# EAGLE design highpower-new5pad (EAGLE 9.2.2)
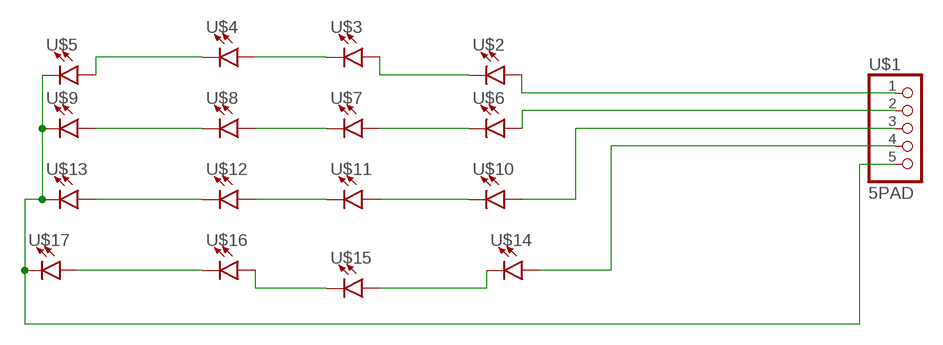
[diagram p0: schematic, sheet 1]

## Parts
U$1  5PAD  [1X05SMD/90]
U$2  LEDHIGHPOWER  [HIGHPOWERLED]
U$3  LEDHIGHPOWER  [HIGHPOWERLED]
U$4  LEDHIGHPOWER  [HIGHPOWERLED]
U$5  LEDHIGHPOWER  [HIGHPOWERLED]
U$6  LEDHIGHPOWER  [HIGHPOWERLED]
U$7  LEDHIGHPOWER  [HIGHPOWERLED]
U$8  LEDHIGHPOWER  [HIGHPOWERLED]
U$9  LEDHIGHPOWER  [HIGHPOWERLED]
U$10  LEDHIGHPOWER  [HIGHPOWERLED]
U$11  LEDHIGHPOWER  [HIGHPOWERLED]
U$12  LEDHIGHPOWER  [HIGHPOWERLED]
U$13  LEDHIGHPOWER  [HIGHPOWERLED]
U$14  LEDHIGHPOWER  [HIGHPOWERLED]
U$15  LEDHIGHPOWER  [HIGHPOWERLED]
U$16  LEDHIGHPOWER  [HIGHPOWERLED]
U$17  LEDHIGHPOWER  [HIGHPOWERLED]

## Nets
N$1: U$1.1 U$2.PO(A)
N$2: U$2.PI(C) U$3.PO(A)
N$3: U$3.PI(C) U$4.PO(A)
N$4: U$4.PI(C) U$5.PO(A)
N$5: U$1.2 U$6.PO(A)
N$6: U$6.PI(C) U$7.PO(A)
N$7: U$7.PI(C) U$8.PO(A)
N$8: U$8.PI(C) U$9.PO(A)
N$9: U$1.3 U$10.PO(A)
N$10: U$10.PI(C) U$11.PO(A)
N$11: U$11.PI(C) U$12.PO(A)
N$12: U$12.PI(C) U$13.PO(A)
N$13: U$1.4 U$14.PO(A)
N$14: U$14.PI(C) U$15.PO(A)
N$15: U$15.PI(C) U$16.PO(A)
N$16: U$16.PI(C) U$17.PO(A)
N$17: U$1.5 U$5.PI(C) U$9.PI(C) U$13.PI(C) U$17.PI(C)

## Library data of the parts
U$1 = highpowerled:5PAD
U$2-U$17 = highpowerled:LEDHIGHPOWER: LED High Power piece

## Board
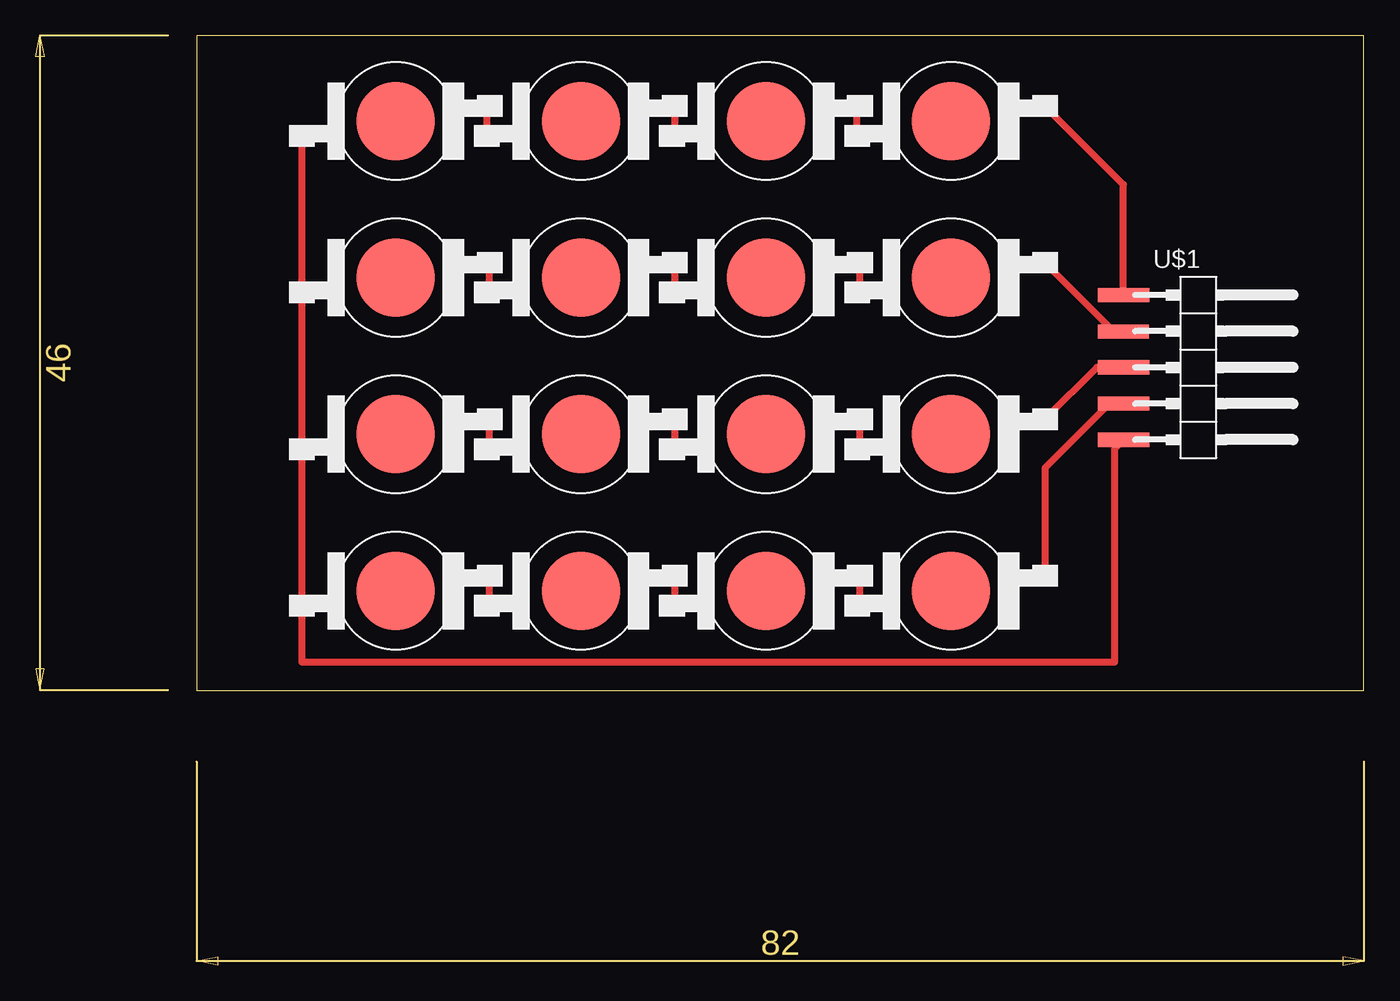
[diagram p1: board, top side]

Size 82 x 46 mm. Coordinates in mm from the lower left corner, seen from the top.
Outline: 0,0 82,0 82,46 0,46 0,0
Copper layers (1*16): Top 0.035mm / dielectric 1.5mm / Bottom 0.035mm
Design rules "default": minimum track width 6mil, minimum drill 0.35mm, track to track 6mil, track to pad 6mil, pad to pad 6mil, via to via 6mil, smd to smd 6mil, copper to edge 40mil, drill to drill 6mil, minimum pad ring 10mil, minimum via ring 8mil, stop-mask expansion 4mil, vias tented up to drill 0mil, thermal gap 10mil

### Footprints (pad centres in the part's own frame; a part is rotated, then mirrored left to right if it is on the bottom)
1X05SMD/90 = smd 1 x 3.6: 1 -1.27,-5.88; 2 1.3,-5.9; 3 3.81,-5.88; 4 6.35,-5.88; 5 8.89,-5.88
HIGHPOWERLED = smd 5.5 x 5.5: PAD 0,0 | smd 1.5 x 1.8: PI -1.05,6.6; PO 1.05,-6.6

### Placement (x,y rotation side)
U$1  71,26.5 270 top
U$2  53,40 90 top
U$3  40,40 90 top
U$4  27,40 90 top
U$5  14,40 90 top
U$6  53,29 90 top
U$7  40,29 90 top
U$8  27,29 90 top
U$9  14,29 90 top
U$10  53,18 90 top
U$11  40,18 90 top
U$12  27,18 90 top
U$13  14,18 90 top
U$14  53,7 90 top
U$15  40,7 90 top
U$16  27,7 90 top
U$17  14,7 90 top

### Tracks (layer width: path | path; a pad name or v marks a point on that pad's centre or on a via)
N$1
  Top 0.5: U$1.1 65.12,35.53 U$2.PO
N$2
  Top 0.5: U$2.PI 46.4,40.85 U$3.PO
N$3
  Top 0.5: U$3.PI 33.6,39.15 U$4.PO
N$4
  Top 0.5: U$4.PI 20.4,40.85 U$5.PO
N$5
  Top 0.5: U$1.2 64.45,25.2 U$6.PO
N$6
  Top 0.5: U$6.PI 46.6,28.15 U$7.PO
N$7
  Top 0.5: U$7.PI 33.6,28.15 U$8.PO
N$8
  Top 0.5: U$8.PI 20.6,28.15 U$9.PO
N$9
  Top 0.5: U$1.3 63.24,22.69 U$10.PO
N$10
  Top 0.5: U$10.PI 46.6,17.15 U$11.PO
N$11
  Top 0.5: U$11.PI 33.6,17.15 U$12.PO
N$12
  Top 0.5: U$12.PI 20.6,17.15 U$13.PO
N$13
  Top 0.5: U$1.4 64.12,20.15 59.6,15.63 U$14.PO
N$14
  Top 0.5: U$14.PI 46.6,6.15 U$15.PO
N$15
  Top 0.5: U$15.PI 33.6,6.15 U$16.PO
N$16
  Top 0.5: U$16.PI 20.6,6.15 U$17.PO
N$17
  Top 0.5: U$5.PI U$9.PI U$13.PI U$17.PI 7.4,2 64.5,2 64.5,16.99 U$1.5